# EAGLE design mit_radar_r2_layout  (EAGLE 9.3.0)

## Sheet 1 of 2
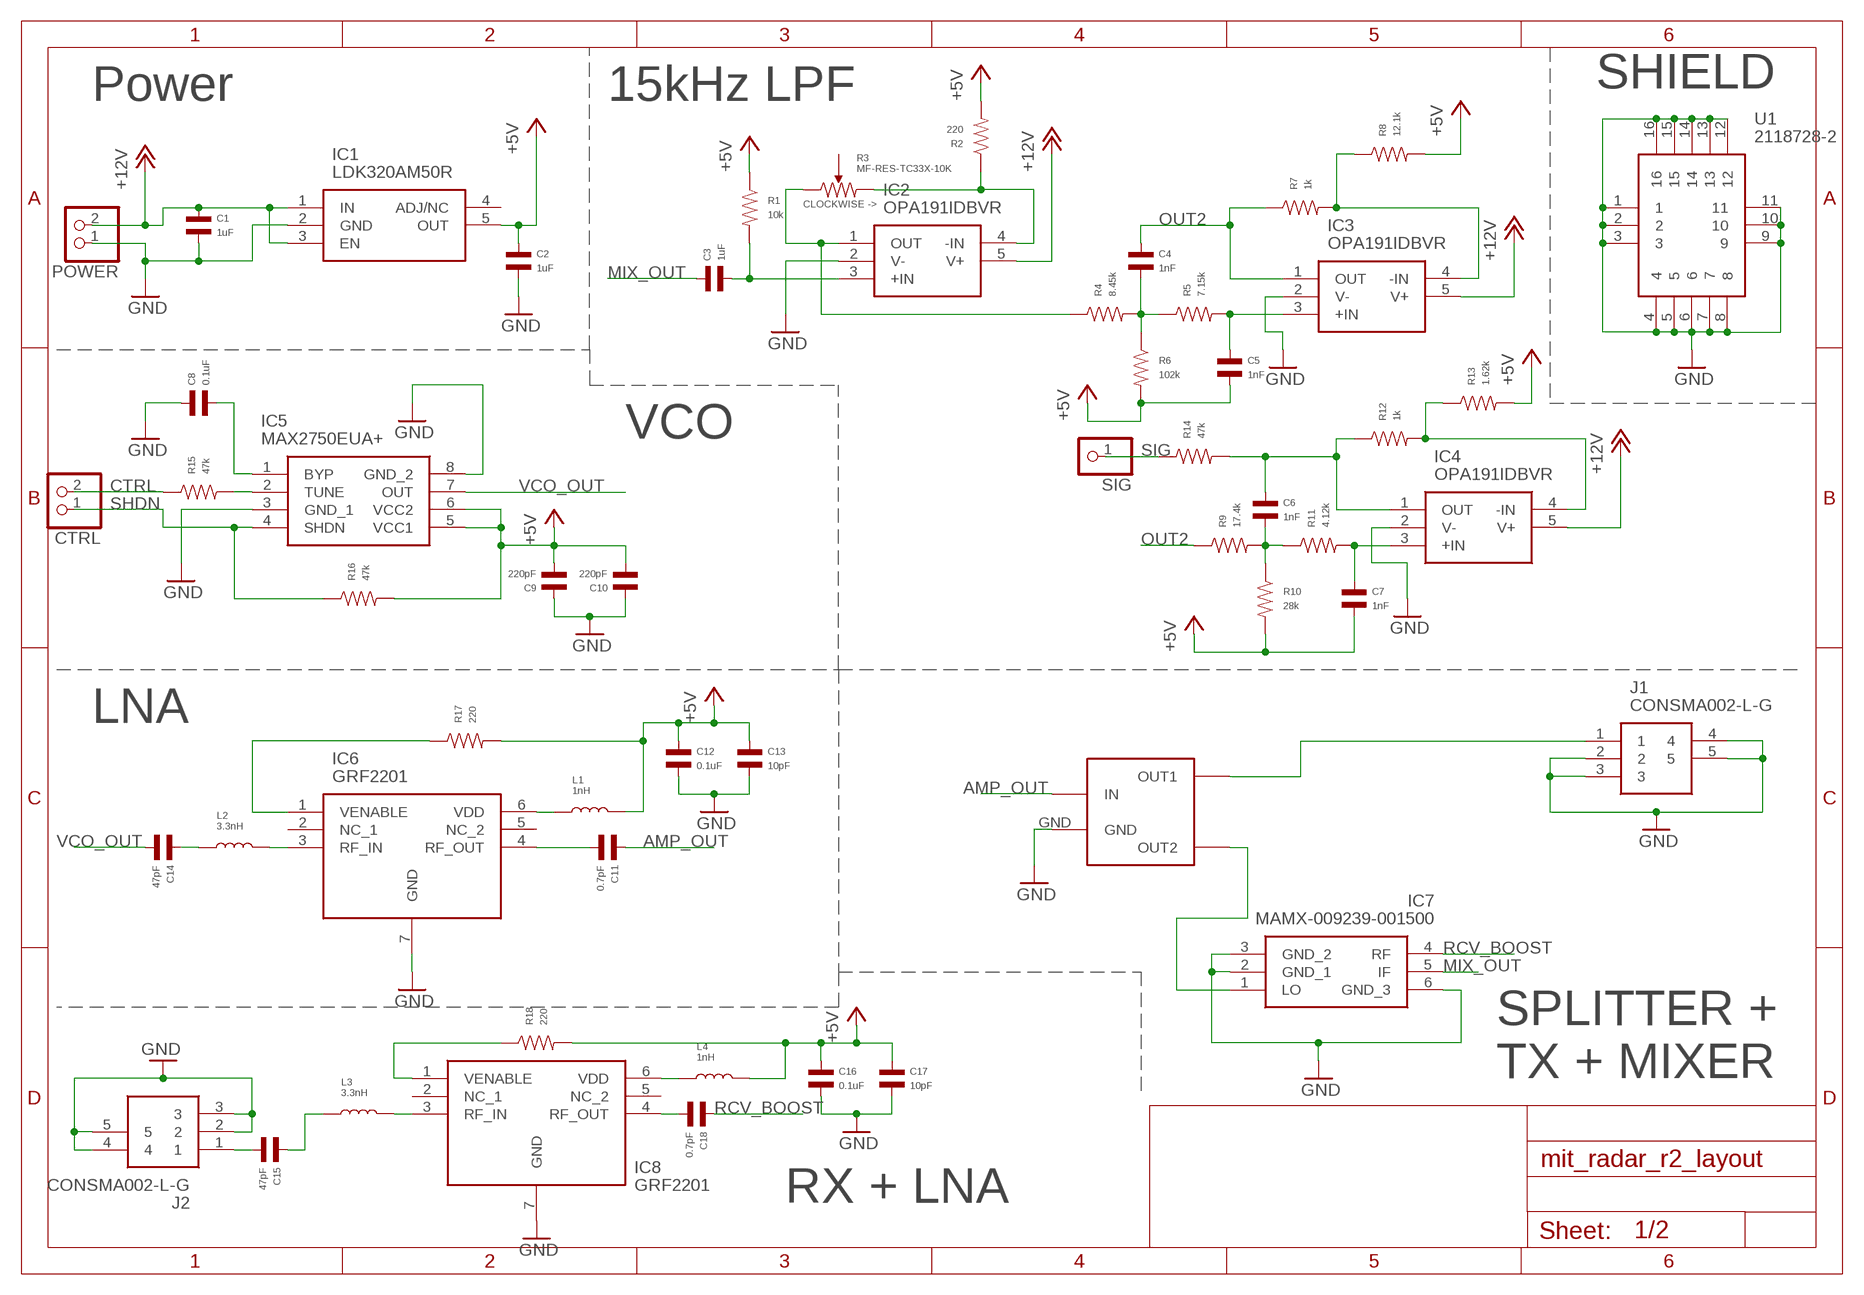
[diagram p0: schematic, sheet 1]

### Parts
C1  1uF  CAPACITOR_NP_0402  [C0402]
C2  1uF  CAPACITOR_NP_0402  [C0402]
C3  1uF  CAPACITOR_NP_0402  [C0402]
C4  1nF  CAPACITOR_NP_0402  [C0402]
C5  1nF  CAPACITOR_NP_0402  [C0402]
C6  1nF  CAPACITOR_NP_0402  [C0402]
C7  1nF  CAPACITOR_NP_0402  [C0402]
C8  0.1uF  CAPACITOR_NP_0402  [C0402]
C9  220pF  CAPACITOR_NP_0402  [C0402]
C10  220pF  CAPACITOR_NP_0402  [C0402]
C11  0.7pF  CAPACITOR_NP_0402  [C0402]
C12  0.1uF  CAPACITOR_NP_0402  [C0402]
C13  10pF  CAPACITOR_NP_0402  [C0402]
C14  47pF  CAPACITOR_NP_0402  [C0402]
C15  47pF  CAPACITOR_NP_0402  [C0402]
C16  0.1uF  CAPACITOR_NP_0402  [C0402]
C17  10pF  CAPACITOR_NP_0402  [C0402]
C18  0.7pF  CAPACITOR_NP_0402  [C0402]
CTRL  PINHD-1X2  [1X02]
IC1  LDK320AM50R  [SOT95P280X145-5N]
IC2  OPA191IDBVR  [SOT95P280X145-5N]
IC3  OPA191IDBVR  [SOT95P280X145-5N]
IC4  OPA191IDBVR  [SOT95P280X145-5N]
IC5  MAX2750EUA+  [SOP65P490X110-8N]
IC6  GRF2201  [SON50P150X150X50-7N]
IC7  MAMX-009239-001500  [MAMX009239001500]
IC8  GRF2201  [SON50P150X150X50-7N]
J1  CONSMA002-L-G  [CONSMA002LG]
J2  CONSMA002-L-G  [CONSMA002LG]
L1  1nH  INDUCTOR_0402  [L0402]
L2  3.3nH  INDUCTOR_0402  [L0402]
L3  3.3nH  INDUCTOR_0402  [L0402]
L4  1nH  INDUCTOR_0402  [L0402]
POWER  PINHD-1X2  [1X02]
R1  10k  RESISTOR_0402  [R0402]
R2  220  RESISTOR_0402  [R0402]
R3  MF-RES-TC33X-10K  POTENTIOMETER_10K_TC33  [TC33]
R4  8.45k  RESISTOR_0402  [R0402]
R5  7.15k  RESISTOR_0402  [R0402]
R6  102k  RESISTOR_0402  [R0402]
R7  1k  RESISTOR_0402  [R0402]
R8  12.1k  RESISTOR_0402  [R0402]
R9  17.4k  RESISTOR_0402  [R0402]
R10  28k  RESISTOR_0402  [R0402]
R11  4.12k  RESISTOR_0402  [R0402]
R12  1k  RESISTOR_0402  [R0402]
R13  1.62k  RESISTOR_0402  [R0402]
R14  47k  RESISTOR_0402  [R0402]
R15  47k  RESISTOR_0402  [R0402]
R16  47k  RESISTOR_0402  [R0402]
R17  220  RESISTOR_0402  [R0402]
R18  220  RESISTOR_0402  [R0402]
SIG  PINHD-1X1  [1X01]
U1  2118728-2  [21187282]
U$1  PS3216GT2-R50-T1  [PS3216GT2-R50-T1]

### Nets
+5V: C2.P$1 C5.P$2 C7.P$2 C9.P$2 C10.P$2 C12.P$1 C13.P$1 C16.P$1 C17.P$1 IC1.5(OUT) IC5.5(VCC1) IC5.6(VCC2) L1.P$2 L4.P$2 R1.P$1 R2.P$2 R6.P$2 R8.P$2 R10.P$2 R13.P$2 R16.P$2 R17.P$2 R18.P$2
+12V: C1.P$1 IC1.1(IN) IC1.3(EN) IC2.5(V+) IC3.5(V+) IC4.5(V+) POWER.2
AMP_OUT: C11.P$1 U$1.IN
CTRL: CTRL.2 R15.P$1 ; also sheet 2
GND: C1.P$2 C2.P$2 C8.P$1 C9.P$1 C10.P$1 C12.P$2 C13.P$2 C16.P$2 C17.P$2 IC1.2(GND) IC2.2(V-) IC3.2(V-) IC4.2(V-) IC5.3(GND_1) IC5.8(GND_2) IC6.7(GND) IC7.2(GND_1) IC7.3(GND_2) IC7.6(GND_3) IC8.7(GND) J1.2 J1.3 J1.4 J1.5 J2.2 J2.3 J2.4 J2.5 POWER.1 U1.1 U1.2 U1.3 U1.4 U1.5 U1.6 U1.7 U1.8 U1.9 U1.10 U1.11 U1.12 U1.13 U1.14 U1.15 U1.16 U$1.GND ; also sheet 2
MIX_OUT: C3.P$1 IC7.5(IF)
N$1: C3.P$2 IC2.3(+IN) R1.P$2
N$2: IC2.4(-IN) R2.P$1 R3.P$3
N$3: IC2.1(OUT) R3.P$1 R4.P$1
N$4: C4.P$2 R4.P$2 R5.P$1 R6.P$1
N$5: C5.P$1 IC3.3(+IN) R5.P$2
N$7: C6.P$2 R9.P$2 R10.P$1 R11.P$1
N$8: C7.P$1 IC4.3(+IN) R11.P$2
N$9: IC3.4(-IN) R7.P$2 R8.P$1
N$10: C6.P$1 IC4.1(OUT) R12.P$1 R14.P$2
N$11: IC4.4(-IN) R12.P$2 R13.P$1
N$13: IC5.2(TUNE) R15.P$2
N$14: C8.P$2 IC5.1(BYP)
N$15: C11.P$2 IC6.4(RF_OUT)
N$17: IC6.6(VDD) L1.P$1
N$18: IC6.1(VENABLE) R17.P$1
N$19: IC6.3(RF_IN) L2.P$2
N$20: C14.P$1 L2.P$1
N$21: IC8.6(VDD) L4.P$1
N$22: J1.1 U$1.OUT1
N$23: IC7.1(LO) U$1.OUT2
N$24: C15.P$1 L3.P$1
N$26: C15.P$2 J2.1
N$28: IC8.3(RF_IN) L3.P$2
N$29: IC8.1(VENABLE) R18.P$1
N$30: C18.P$2 IC8.4(RF_OUT)
OUT2: C4.P$1 IC3.1(OUT) R7.P$1 R9.P$1
RCV_BOOST: C18.P$1 IC7.4(RF)
SHDN: CTRL.1 IC5.4(SHDN) R16.P$1 ; also sheet 2
SIG: R14.P$1 SIG.1 ; also sheet 2
VCO_OUT: C14.P$2 IC5.7(OUT)
Unconnected: IC1.4(ADJ/NC) IC6.2(NC_1) IC6.5(NC_2) IC8.2(NC_1) IC8.5(NC_2) R3.P$2

### Notes on the sheet
- Power | 15kHz LPF | SHIELD
- VCO
- LNA
- SPLITTER + 
  TX + MIXER
- RX + LNA

## Sheet 2 of 2
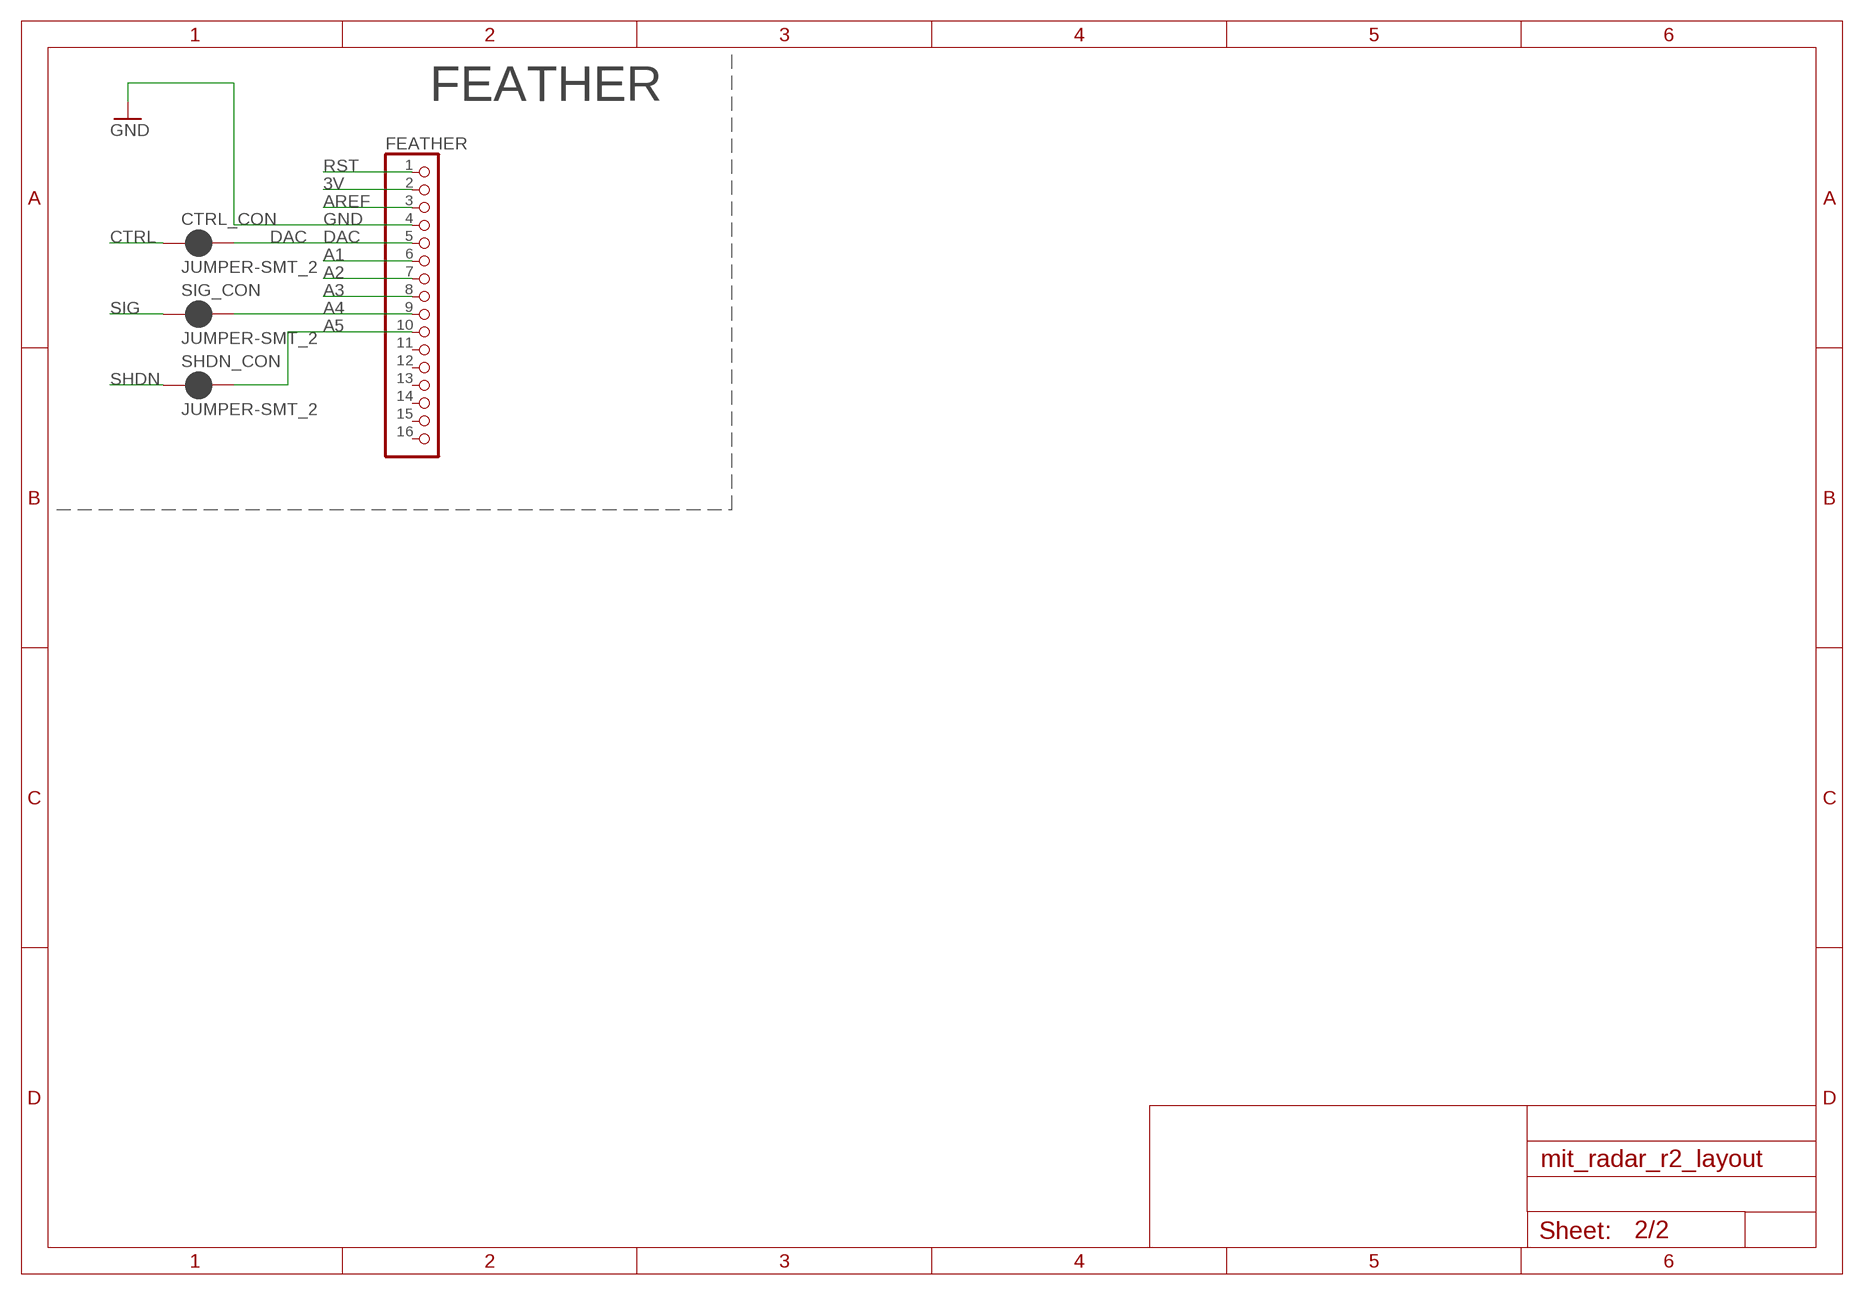
[diagram p1: schematic, sheet 2]

### Parts
CTRL_CON  JUMPER-SMT_2  JUMPER-SMT_2_NC_PASTE_NO-SILK  [SMT-JUMPER_2_NC_PASTE_NO-SILK]
FEATHER  PINHD-1X16  [1X16]
SHDN_CON  JUMPER-SMT_2  JUMPER-SMT_2_NC_PASTE_NO-SILK  [SMT-JUMPER_2_NC_PASTE_NO-SILK]
SIG_CON  JUMPER-SMT_2  JUMPER-SMT_2_NC_PASTE_NO-SILK  [SMT-JUMPER_2_NC_PASTE_NO-SILK]

### Nets
3V: FEATHER.2
A1: FEATHER.6
A2: FEATHER.7
A3: FEATHER.8
A4: FEATHER.9 SIG_CON.2
A5: FEATHER.10 SHDN_CON.2
AREF: FEATHER.3
CTRL: CTRL_CON.1 ; also sheet 1
DAC: CTRL_CON.2 FEATHER.5
GND: FEATHER.4 ; also sheet 1
RST: FEATHER.1
SHDN: SHDN_CON.1 ; also sheet 1
SIG: SIG_CON.1 ; also sheet 1
Unconnected: FEATHER.11 FEATHER.12 FEATHER.13 FEATHER.14 FEATHER.15 FEATHER.16

### Notes on the sheet
- FEATHER

## Library data of the parts
C1-C18 = MF_Passives:CAPACITOR_NP: Library: MF_Passives Description: Device for Non-Polarized Capacitors. Manufacture part number (MPN) can be added via Attributes. Check https://factory.macrofab.com/parts for the house parts list.; POPULATE: 1
CTRL POWER = pinhead:PINHD-1X2: PIN HEADER
CTRL_CON SHDN_CON SIG_CON = SparkFun-Jumpers:JUMPER-SMT_2_NC_PASTE: Normally closed solder jumper This jumper has an aperture in the stencil to allow solder paste to bridge the split in the wire so it's normally closed (NC). Wick off the solder to open the connection. Reapply solder to reclose the connection.
FEATHER = pinhead:PINHD-1X16: PIN HEADER
IC1 = samacsys:LDK320AM50R: LDO Voltage Regulators 200 mA low quiescent current and high PSRR voltage regulator Source: Datasheet <http://www.st.com/resource/en/datasheet/ldk320.pdf>; DESCRIPTION: LDO Voltage Regulators 200 mA low quiescent current and high PSRR voltage regulator; HEIGHT: 1.45mm; MANUFACTURER_NAME: STMicroelectronics; MANUFACTURER_PART_NUMBER: LDK320AM50R; MOUSER_PART_NUMBER: 511-LDK320AM50R; MOUSER_PRICE-STOCK: https://www.mouser.com/Search/Refine.aspx?Keyword=511-LDK320AM50R
IC2-IC4 = samacsys:OPA191IDBVR: Precision Amplifiers Low-Power, Precision, 36-V, e-trim CMOS Amplifier 5-SOT-23 -40 to 125 Source: Datasheet <http://www.mouser.com/ds/2/405/opa191-806478.pdf>; DESCRIPTION: Precision Amplifiers Low-Power, Precision, 36-V, e-trim CMOS Amplifier 5-SOT-23 -40 to 125; HEIGHT: 1.45mm; MANUFACTURER_NAME: Texas Instruments; MANUFACTURER_PART_NUMBER: OPA191IDBVR; MOUSER_PART_NUMBER: 595-OPA191IDBVR; MOUSER_PRICE-STOCK: https://www.mouser.com/Search/Refine.aspx?Keyword=595-OPA191IDBVR
IC5 = samacsys:MAX2750EUA+: Maxim,MAX2750EUA+ Maxim,MAX2750EUA+ Source: Datasheet <http://www.farnell.com/datasheets/2001017.pdf>; DESCRIPTION: Maxim,MAX2750EUA+ Maxim,MAX2750EUA+; HEIGHT: 1.1mm; MANUFACTURER_NAME: Maxim Integrated; MANUFACTURER_PART_NUMBER: MAX2750EUA+; MOUSER_PART_NUMBER: 700-MAX2750EUA; MOUSER_PRICE-STOCK: https://www.mouser.com/Search/Refine.aspx?Keyword=700-MAX2750EUA; RS_PART_NUMBER: 1898516P; RS_PRICE-STOCK: http://uk.rs-online.com/web/p/products/1898516P
IC6 IC8 = samacsys:GRF2201: RF Amplifier Source: Datasheet <https://www.guerrilla-rf.com/prodFiles/2201/GRF2201DS.pdf>; DESCRIPTION: RF Amplifier; HEIGHT: 0.5mm; MANUFACTURER_NAME: Guerrilla RF; MANUFACTURER_PART_NUMBER: GRF2201; MOUSER_PART_NUMBER: 459-GRF2201; MOUSER_PRICE-STOCK: https://www.mouser.com/Search/Refine.aspx?Keyword=459-GRF2201
IC7 = samacsys:MAMX-009239-001500: RF Mixer RF/LO/IF 10-2500MHz -10C +85C Source: Datasheet <https://cdn.macom.com/datasheets/MAMX-009239-001500.pdf>; DESCRIPTION: RF Mixer RF/LO/IF 10-2500MHz -10C +85C; HEIGHT: 4.85mm; MANUFACTURER_NAME: MACOM; MANUFACTURER_PART_NUMBER: MAMX-009239-001500; MOUSER_PART_NUMBER: 937-MAMX-9239-001500; MOUSER_PRICE-STOCK: https://www.mouser.com/Search/Refine.aspx?Keyword=937-MAMX-9239-001500
J1 J2 = samacsys:CONSMA002-L-G: RF Connectors / Coaxial Connectors SMA Fml Right Angle PCB Mount, Extended Source: Datasheet <https://linxtechnologies.com/wp/wp-content/uploads/CONSMA002-L-G.pdf>; DESCRIPTION: RF Connectors / Coaxial Connectors SMA Fml Right Angle PCB Mount, Extended; HEIGHT: 10mm; MANUFACTURER_NAME: Linx Technologies; MANUFACTURER_PART_NUMBER: CONSMA002-L-G; MOUSER_PART_NUMBER: 712-CONSMA002-L-G; MOUSER_PRICE-STOCK: https://www.mouser.com/Search/Refine.aspx?Keyword=712-CONSMA002-L-G
L1-L4 = MF_Passives:INDUCTOR: Library: MF_Passives Description: Device for Inductors. Manufacture part number (MPN) can be added via Attributes. Check https://factory.macrofab.com/parts for the house parts list.; POPULATE: 1
R1 R2 R4-R18 = MF_Passives:RESISTOR: Library: MF_Passives Description: Device for Resistors. Manufacture part number (MPN), Voltage, Tolerance, and Wattage Rating can be added via Attributes. Check https://factory.macrofab.com/parts for the house parts list.; POPULATE: 1
R3 = MF_Passives:POTENTIOMETER: Library: MF_Passives Description: Device for Potentiometers. Manufacture part number (MPN) can be added via Attributes. Check https://factory.macrofab.com/parts for the house parts list.; HOUSEPART: YES; MPN: MF-RES-TC33X-10K; POPULATE: 1; TOLERANCE: 25%; URL: https://factory.macrofab.com/part/MF-RES-TC33X-10K; WATTAGE: 100mW
SIG = pinhead:PINHD-1X1: PIN HEADER
U1 = samacsys:2118728-2: STD SHIELD FRAME, CRS-29.36X18.50X7.00MM Source: Datasheet <https://www.te.com/commerce/DocumentDelivery/DDEController?Action=showdoc&DocId=Customer Drawing2118728A2pdfEnglishENG_CD_2118728_A2.pdf2118728-2>; ALLIED_NUMBER: 71038421; ALLIED_PRICE-STOCK: https://www.alliedelec.com/te-connectivity-2118728-2/71038421/; DESCRIPTION: STD SHIELD FRAME, CRS-29.36X18.50X7.00MM; HEIGHT: 7mm; MANUFACTURER_NAME: TE Connectivity; MANUFACTURER_PART_NUMBER: 2118728-2; MOUSER_PART_NUMBER: 571-2118728-2; MOUSER_PRICE-STOCK: https://www.mouser.com/Search/Refine.aspx?Keyword=571-2118728-2; RS_PART_NUMBER: 1720955; RS_PRICE-STOCK: http://uk.rs-online.com/web/p/products/1720955
U$1 = susumu:PS3216GT2-R50-T1

## Board
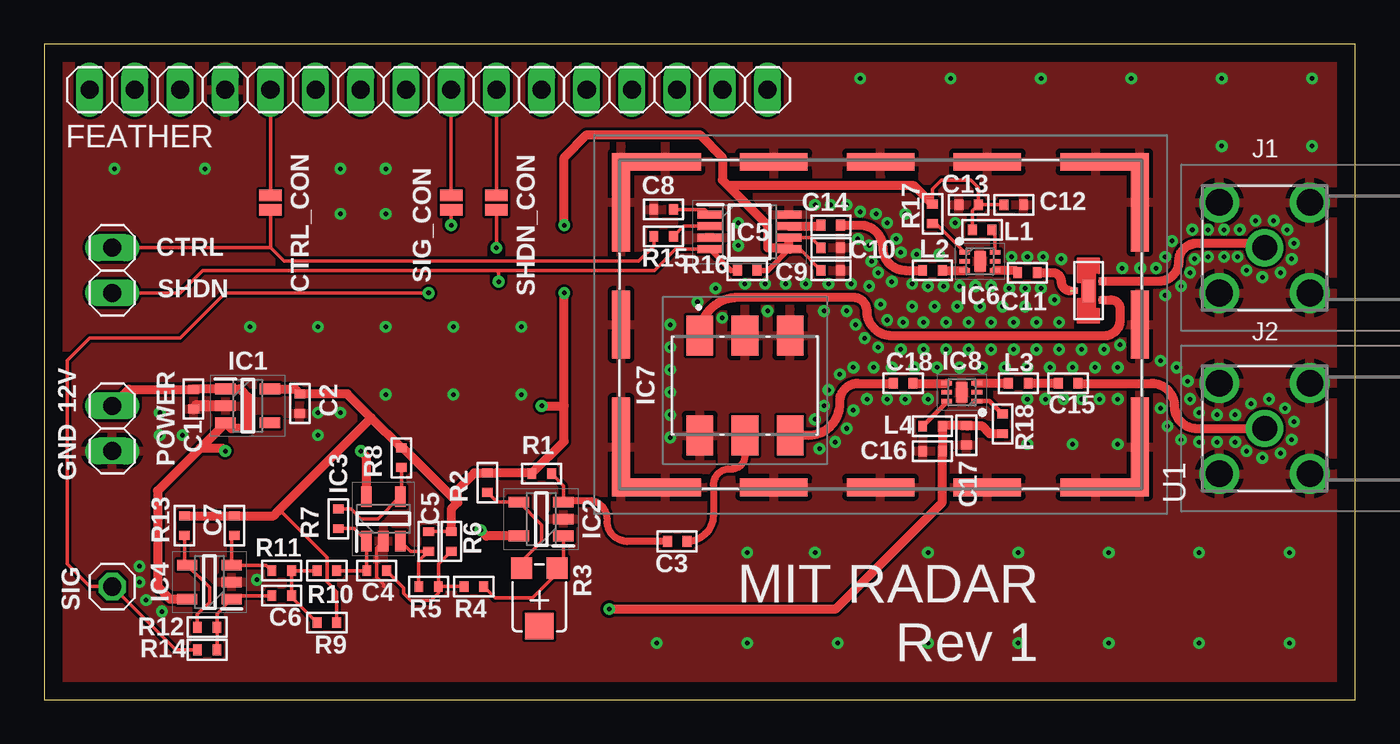
[diagram p2: board, top side]
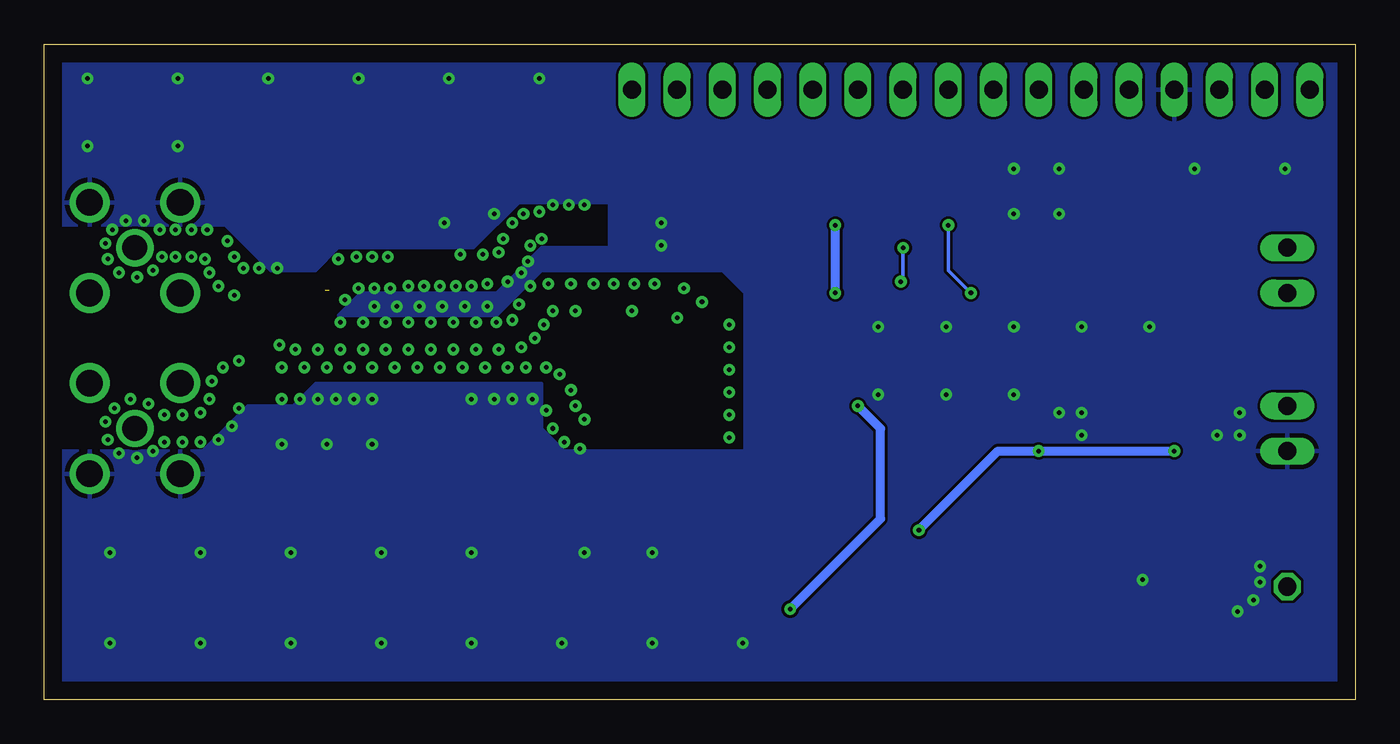
[diagram p3: board, bottom side, seen from below]

Size 73.66 x 36.83 mm. Coordinates in mm from the lower left corner, seen from the top.
Outline: 0,0 73.66,0 73.66,36.83 0,36.83 0,0
Copper layers (1*16): Top 0.035mm / dielectric 1.5mm / Bottom 0.035mm
Design rules "default": minimum track width 6mil, minimum drill 0.35mm, track to track 6mil, track to pad 6mil, pad to pad 6mil, via to via 6mil, smd to smd 6mil, copper to edge 40mil, drill to drill 6mil, minimum pad ring 10mil, minimum via ring 8mil, stop-mask expansion 4mil, vias tented up to drill 25mil, thermal gap 10mil

### Footprints (pad centres in the part's own frame; a part is rotated, then mirrored left to right if it is on the bottom)
C0402 = smd 0.5 x 0.6: P$1 -0.55,0; P$2 0.55,0
1X02 = drill 1.016 long: 1 -1.27,0; 2 1.27,0
SMT-JUMPER_2_NC_PASTE_NO-SILK = smd 0.635 x 1.27: 1 -0.406,0; 2 0.406,0
1X16 = drill 1.016 long: 1 -19.05,0; 2 -16.51,0; 3 -13.97,0; 4 -11.43,0; 5 -8.89,0; 6 -6.35,0; 7 -3.81,0; 8 -1.27,0; 9 1.27,0; 10 3.81,0; 11 6.35,0; 12 8.89,0; 13 11.43,0; 14 13.97,0; 15 16.51,0; 16 19.05,0
SOT95P280X145-5N = smd 1.15 x 0.6: 1 -1.25,0.95; 2 -1.25,0; 3 -1.25,-0.95; 4 1.25,-0.95; 5 1.25,0.95
SOP65P490X110-8N = smd 1.425 x 0.45: 1 -2.212,0.975; 2 -2.212,0.325; 3 -2.212,-0.325; 4 -2.212,-0.975; 5 2.212,-0.975; 6 2.212,-0.325; 7 2.212,0.325; 8 2.212,0.975
SON50P150X150X50-7N = smd 0.6 x 0.25: 1 -0.85,0.5; 2 -0.85,0; 3 -0.85,-0.5; 4 0.85,-0.5; 5 0.85,0; 6 0.85,0.5 | smd 0.65 x 1.15: 7 0,0
MAMX009239001500 = smd 2.26 x 1.5: 1 2.805,2.54; 2 2.805,0; 3 2.805,-2.54; 4 -2.805,-2.54; 5 -2.805,0; 6 -2.805,2.54
CONSMA002LG = drill 1.4 pad 2.1: 1 0,0 | drill 1.5 pad 2.25: 2 -2.55,2.55; 3 -2.55,-2.55; 4 2.55,-2.55; 5 2.55,2.55
L0402 = smd 0.5 x 0.6: P$1 -0.55,0; P$2 0.55,0
R0402 = smd 0.5 x 0.6: P$1 -0.55,0; P$2 0.55,0
TC33 = smd 1.2 x 1.2: P$1 -1.8,1; P$3 -1.8,-1 | smd 1.5 x 1.6: P$2 1.45,0
1X01 = drill 1.016 octagon: 1 0,0
21187282 = smd 1 x 5.55: 1 -14.58,6.875; 3 -14.58,-6.875; 9 14.58,-6.875; 11 14.58,6.875 | smd 1 x 3.8: 2 -14.58,0; 10 14.58,0 | smd 3.98 x 1: 4 -12.09,-9.15; 8 12.09,-9.15; 12 12.09,9.15; 16 -12.09,9.15 | smd 3.8 x 1: 5 -6,-9.15; 6 0,-9.15; 7 6,-9.15; 13 6,9.15; 14 0,9.15; 15 -6,9.15
PS3216GT2-R50-T1 = smd 1.27 x 0.635: GND 0,0 | smd 0.35 x 0.4: IN 0,0.8 | smd 0.4 x 0.4: OUT1 0.525,-0.8; OUT2 -0.525,-0.8

### Placement (x,y rotation side)
C1  8.38,16.89 270 top
C2  14.35,16.64 270 top
C3  35.56,8.89 180 top
C4  18.67,7.24 0 top
C5  21.59,8.89 90 top
C6  13.34,5.84 0 top
C7  10.67,9.78 90 top
C8  34.8,27.56 0 top
C9  44.2,24.13 180 top
C10  44.2,25.4 180 top
C11  55.24,24 180 top
C12  54.48,27.81 0 top
C13  51.94,27.81 180 top
C14  44.2,26.67 180 top
C15  57.53,17.78 0 top
C16  49.91,13.97 180 top
C17  51.82,14.86 270 top
C18  48.26,17.78 0 top
CTRL  3.81,24.13 90 top
CTRL_CON  12.7,27.94 90 top
FEATHER  21.59,34.29 0 top
IC1  11.43,16.51 0 top
IC2  27.92,10.15 180 top
IC3  19.05,10.16 90 top
IC4  9.27,6.6 180 top
IC5  39.62,26.29 0 top
IC6  52.58,24.64 0 top
IC7  39.37,17.65 90 top
IC8  51.56,17.27 180 top
J1  68.58,25.4 0 top
J2  68.58,15.24 0 top
L1  52.7,26.42 180 top
L2  49.91,24.13 0 top
L3  54.74,17.78 180 top
L4  49.91,15.37 0 top
POWER  3.81,15.24 90 top
R1  27.94,12.7 0 top
R2  24.89,12.19 90 top
R3  27.81,5.59 270 top
R4  24.13,6.35 180 top
R5  21.59,6.35 180 top
R6  22.86,8.89 90 top
R7  16.51,10.16 90 top
R8  20.07,13.59 90 top
R9  15.88,7.24 180 top
R10  15.88,4.32 0 top
R11  13.34,7.24 180 top
R12  9.14,4.06 180 top
R13  7.87,9.78 90 top
R14  9.14,2.79 0 top
R15  34.8,26.04 0 top
R16  39.5,24.13 0 top
R17  49.91,27.3 90 top
R18  53.85,15.49 270 top
SHDN_CON  25.4,27.94 90 top
SIG  3.81,6.35 0 top
SIG_CON  22.86,27.94 90 top
U1  46.99,21.08 180 top
U$1  58.67,22.99 90 top

### Tracks (layer width: path | path; a pad name or v marks a point on that pad's centre or on a via)
+5V  (via drill 0.25)
  Top 0.203: L1.P$2 52.16,27.48 C13.P$1 | C13.P$1 C12.P$1 | C13.P$1 52.49,28.79 52.07,29.21 50.42,29.21 49.91,28.7 R17.P$2 | IC5.6 43.08,25.96 C10.P$2 | IC5.5 41.91,25.31 42.46,25.31 C9.P$2 | C16.P$1 50.5,14.01 | 25.4,12.74 R2.P$2 | R6.P$2 C5.P$2 | 23.14,11.07 23.22,11.07 | R10.P$2 16.43,6.05 15.88,6.6 15.88,8 13.27,10.6 13.14,10.6
  Top 0.254: 51.86,15.37 C17.P$1 | 50.5,15.41 L4.P$2
  Top 0.305: R16.P$2 40.65,24.13 IC5.5
  Top 0.508: 23.22,11.07 22.86,10.71 R6.P$2 | R13.P$2 C7.P$2 12.87,10.33 13.14,10.6 18.37,15.83 | 18.37,15.83 R8.P$2 20.15,14.14 23.22,11.07 | 18.37,15.83 17.02,17.19 C2.P$1 14.08,17.46 IC1.5 | 23.22,11.07 23.22,11.79 24.17,12.74 25.4,12.74 27.35,12.74 R1.P$1 29.21,14.52 29.21,16.51 | 29.21,16.51 v29.21,22.86 | v29.21,26.67 29.21,30.48 30.48,31.75 36.83,31.75 38.1,30.48 38.1,29.21 38.42,28.89 | 41.82,25.4 40.64,25.4 40.64,26.67 38.42,28.89 | 41.82,25.4 41.91,25.31 | IC5.6 41.82,25.95 41.82,25.4 | R17.P$2 48.87,28.89 38.42,28.89 | v31.75,5.08 44.45,5.08 50.46,11.09 C16.P$1 L4.P$2 | v27.94,16.51 29.21,16.51 | R18.P$2 53.13,14.94 52.7,15.37 51.86,15.37 | C17.P$1 50.5,15.41
  Bottom 0.508: v29.21,22.86 v29.21,26.67 | v31.75,5.08 26.67,10.16 26.67,15.24 v27.94,16.51
+12V  (via drill 0.25)
  Top 0.203: 8.4,17.46 C1.P$1
  Top 0.508: POWER.2 4.74,17.44 C1.P$1 | 8.4,17.46 IC1.1 10.99,17.46 11.43,17.02 11.43,15.24 10.5,15.24 IC1.3 8.74,14.12 | 8.74,14.12 6.35,11.73 6.35,6.35 7.05,5.65 IC4.5 | IC2.5 24.84,9.2 v24.51,9.53 | v10.16,13.97 10.01,14.12 8.74,14.12 | IC3.5 18.1,13.65 v17.78,13.97
  Bottom 0.508: v24.51,9.53 20.07,13.97 v17.78,13.97 v10.16,13.97
A4
  Top 0.203: SIG_CON.2 FEATHER.9
A5
  Top 0.203: SHDN_CON.2 FEATHER.10
AMP_OUT  (1 unrouted)
  Top 0.508: C11.P$1 56.64,24 arc-90 57.15,23.5 arc90 57.66,22.99
CTRL
  Top 0.203: R15.P$1 34.25,25.48 33.4,24.64 13.46,24.64 12.7,25.4 | 12.7,25.4 CTRL_CON.1 | CTRL.2 12.7,25.4
DAC
  Top 0.203: CTRL_CON.2 FEATHER.5
GND  (via drill 0.25)
  Top 0.203: IC3.2 18.67,8.53 18.67,6.86 19.05,6.48 19.05,6.35
  Top 0.61: IC1.2 8.55,16.51 C1.P$2
  other vias: 45.85,27.43 46.74,27.3 47.37,26.8 47.88,25.91 48.13,25.15 49.02,25.02 50.29,25.02 45.72,25.91 46.35,25.53 46.48,24.64 46.86,24 47.62,23.5 48.77,23.37 49.66,23.24 50.55,23.24 51.44,23.24 52.32,23.24 53.21,23.24 54.23,23.11 55.12,23.11 56.01,23.11 56.77,22.48 54.36,24.89 55.24,24.89 57.15,24.77 56.13,24.89 61.59,24.26 60.58,24.26 62.48,24.26 62.99,24.89 63.37,25.78 64.52,26.42 65.41,26.42 66.29,26.42 67.18,26.42 67.06,24.89 66.29,24.89 65.41,24.89 64.64,24.77 64.39,24 62.99,22.73 63.88,23.24 60.45,19.94 59.56,19.68 58.29,19.68 57.02,19.68 55.75,19.68 54.48,19.68 53.21,19.68 51.94,19.68 50.67,19.68 49.4,19.68 48.13,19.68 46.86,19.81 46.1,20.32 45.59,21.08 57.02,21.21 55.75,21.21 54.48,21.21 53.21,21.21 51.94,21.21 50.67,21.21 49.4,21.21 48.26,21.21 46.99,22.23 47.37,21.34 45.09,21.84 43.81,21.84 46.35,23.24 45.34,23.37 44.07,23.37 42.8,23.37 41.66,23.37 40.51,23.37 39.37,23.37 37.72,23.11 36.7,22.35 46.1,20.32 43.31,15.75 43.81,16.51 44.07,17.4 44.7,18.29 43.56,14.1 44.45,14.48 45.09,15.24 45.47,16.26 40.64,21.84 38.1,21.46 55.24,16.89 56.26,16.89 57.28,16.89 58.29,16.89 59.31,16.89 60.33,16.89 62.74,16.38 60.33,18.67 62.74,19.05 63.63,18.67 63.12,15.37 63.88,14.61 64.9,14.48 65.91,14.48 66.93,14.48 66.93,16 65.91,16 64.26,17.91 64.39,16.89 64.9,16.13 5.33,7.49 5.33,6.6 5.71,5.59 6.6,4.95 51.18,26.8 15.37,16.13 16.64,16.13 15.37,14.86 6.48,16.13 6.48,14.86 7.75,14.86 11.94,6.73 38.99,26.8 38.99,25.53 48.39,27.3 55.12,22.1 52.58,22.1 50.04,22.1 48.77,22.1 51.31,22.1 53.85,22.1 11.56,20.95 15.37,20.95 19.18,20.95 22.99,20.95 26.8,20.95 22.99,17.14 26.8,17.14 19.18,17.14 69.98,8.26 69.98,3.17 64.9,3.17 59.82,3.17 54.74,3.17 49.66,3.17 44.58,3.17 39.5,3.17 34.42,3.17 71.25,31.11 71.25,34.92 66.17,34.92 61.09,34.92 56.01,34.92 50.93,34.92 45.85,34.92 39.5,8.26 43.31,8.26 3.94,29.84 9.02,29.84 64.9,8.26 59.82,8.26 54.74,8.26 49.66,8.26 66.17,31.11 69.72,16.38 70.23,15.62 70.1,14.61 69.47,13.84 68.45,13.59 67.56,13.97 68.83,16.89 67.82,16.64 68.07,26.92 69.09,26.92 69.85,26.42 70.1,24.77 70.23,25.65 69.47,24 68.45,23.75 67.56,24.13 16.64,29.84 19.18,29.84 16.64,27.3 19.18,27.3 44.2,27.81 43.31,27.81 45.09,27.81 46.23,16.89 47.37,16.89 48.39,16.89 49.66,16.89 59.05,18.67 57.78,18.67 56.52,18.67 55.24,18.67 53.98,18.67 52.7,18.67 51.44,18.67 50.16,18.67 48.9,18.67 47.62,18.67 46.61,18.67 45.47,18.67 55.24,14.35 57.78,14.35 60.33,14.35 35.18,21.08 35.18,19.81 35.18,18.54 35.18,17.27 35.18,16 35.18,14.73
  pour Top: 0,0 76.2,0 76.2,39.37 0,39.37
  pour Bottom: 0,0 76.2,0 76.2,12.7 74.93,13.97 64.77,13.97 62.23,16.51 59.69,16.51 58.42,17.78 45.72,17.78 45.72,15.24 44.45,13.97 34.29,13.97 34.29,22.86 35.56,24.13 41.91,24.13 41.91,27.94 46.99,27.94 49.53,25.4 57.15,25.4 58.42,24.13 60.96,24.13 63.5,26.67 76.2,26.67 76.2,38.1 74.93,39.37 1.27,39.37 0,38.1
  pour Bottom: 41.91,25.4 45.72,25.4 46.99,24.13 48.26,22.86 55.88,22.86 57.15,21.59 48.26,21.59 45.72,24.13 41.91,24.13
MIX_OUT
  Top 0.203: 38.61,12.95 38.48,12.95
  Top 0.406: IC7.5 39.37,13.72 arc-90 38.61,12.95 | 38.48,12.95 arc90 37.59,12.06 37.59,10.37 arc-90 C3.P$1
N$1
  Top 0.203: 31.62,10.03 31.62,10.16 | 29.25,11.18 arc90 IC2.3 29.17,12.02 R1.P$2
  Top 0.406: C3.P$2 32.77,8.89 arc-90 31.62,10.03 | 31.62,10.16 arc90 30.61,11.18 29.25,11.18
N$2
  Top 0.203: R3.P$3 26.81,7.76 27.94,8.89 27.94,9.83 IC2.4 25.43,11.1 R2.P$1
N$3
  Top 0.203: IC2.1 29.17,7.75 R3.P$1 28.81,7.1 27.43,5.71 25.32,5.71 R4.P$1
N$4
  Top 0.203: R4.P$2 R5.P$1 | R5.P$1 22.14,7.62 R6.P$1 | C4.P$2 20.19,6.26 20.19,5.97 20.57,5.59 21.72,5.59 22.14,6.01 R5.P$1
N$5
  Top 0.203: R5.P$2 21.04,7.79 C5.P$1 20.57,8.34 IC3.3
N$7
  Top 0.203: R9.P$2 R11.P$1 C6.P$2 13.88,5.76 R10.P$1
N$8
  Top 0.203: R11.P$2 12.47,7.55 IC4.3 10.52,9.08 C7.P$1
N$9
  Top 0.203: R8.P$1 20.07,11.48 IC3.4 18.75,10.16 17.78,10.16 17.23,10.71 R7.P$2
N$10
  Top 0.203: C6.P$1 10.71,5.84 IC4.1 9.69,4.83 R12.P$1 R14.P$2
N$11
  Top 0.203: R13.P$1 7.87,7.7 IC4.4 9.27,6.3 9.27,5.46 8.59,4.78 R12.P$2
N$13
  Top 0.203: R15.P$2 35.93,26.61 IC5.2
N$14
  Top 0.203: C8.P$2 37.12,27.56 IC5.1
N$15
  Top 0.203: 54.56,24.14 arc-90 C11.P$2
  Top 0.508: IC6.4 54.56,24.14
N$17
  Top 0.203: IC6.6 53.43,26.24 L1.P$1
N$18
  Top 0.203: IC6.1 50.11,26.75 R17.P$1
N$19
  Top 0.203: IC6.3 arc90 IC6.3
  Top 0.508: L2.P$2 IC6.3
N$20
  Top 0.508: C14.P$1 45.85,26.67 arc-90 47.12,25.4 arc90 48.39,24.13 L2.P$1
N$21
  Top 0.203: 50.71,16.72 IC8.6
  Top 0.254: L4.P$1 50.71,16.72
N$22
  Top 0.508: J1.1 arc90 68.33,25.65 64.77,25.65 arc90 63.75,24.64 arc-90 62.63,23.51 U$1.OUT1
N$23
  Top 0.203: U$1.OUT2 59.58,22.46
  Top 0.508: IC7.1 arc-90 38.98,22.61 45.47,22.61 arc-90 46.23,21.84 arc90 47.62,20.45 59.56,20.45 arc90 60.45,21.34 60.45,21.97 arc90 59.96,22.46 U$1.OUT2
N$24
  Top 0.508: C15.P$1 L3.P$1
N$26
  Top 0.508: C15.P$2 62.23,17.78 arc-90 63.5,16.51 arc90 64.77,15.24 J2.1
N$28
  Top 0.203: IC8.3 arc90 IC8.3
  Top 0.508: L3.P$2 IC8.3
N$29
  Top 0.254: IC8.1 53.12,16.77 R18.P$1
N$30
  Top 0.203: C18.P$2 arc-90 C18.P$2
  Top 0.508: C18.P$2 IC8.4 arc-90 IC8.4
OUT2
  Top 0.203: R7.P$1 17.4,9.61 IC3.1 18.12,8.89 C4.P$1 R9.P$1
RCV_BOOST
  Top 0.203: IC7.4 arc90 IC7.4
  Top 0.508: IC7.4 42.93,14.86 arc90 44.7,16.64 44.7,16.76 arc-90 45.72,17.78 C18.P$1
SHDN  (via drill 0.25)
  Top 0.203: 37.64,25.31 IC5.4 35.47,25.31 34.29,24.13 25.4,24.13 | CTRL.1 7.62,22.86 8.89,24.13 25.4,24.13 | SHDN_CON.1 v25.4,25.4 | v25.53,23.5 25.53,24 25.4,24.13
  Top 0.305: IC5.4 38.6,24.13 R16.P$1
  Bottom 0.203: v25.4,25.4 25.4,23.62 v25.53,23.5
SIG  (via drill 0.25)
  Top 0.203: R14.P$1 7.37,2.79 SIG.1 2.54,6.35 1.27,7.62 1.27,19.05 2.54,20.32 7.62,20.32 10.16,22.86 v21.59,22.86 | v22.86,26.67 SIG_CON.1
  Bottom 0.203: v21.59,22.86 22.86,24.13 v22.86,26.67
VCO_OUT
  Top 0.203: IC5.7 arc-90 41.89,26.67
  Top 0.508: IC5.7 43.59,26.61 arc90 C14.P$2

### Text on the board
tNames: SHDN | 12V | GND | MIT RADAR / Rev 1